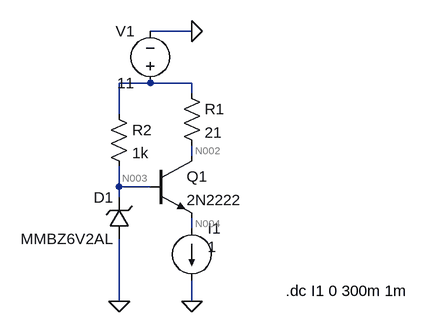
[diagram p0: schematic zener_with_current_limit.asc]
zener_with_current_limit.asc, the LTspice schematic file:
Version 4
SHEET 1 880 680
WIRE 224 -64 160 -64
WIRE 160 16 112 16
WIRE 224 16 160 16
WIRE 224 32 224 16
WIRE 112 64 112 16
WIRE 224 128 224 112
WIRE 112 176 112 144
WIRE 160 176 112 176
WIRE 112 192 112 176
WIRE 224 240 224 224
WIRE 112 352 112 256
WIRE 224 352 224 320
FLAG 112 352 0
FLAG 224 -64 0
FLAG 224 352 0
SYMBOL npn 160 128 R0
SYMATTR InstName Q1
SYMATTR Value 2N2222
SYMBOL res 208 16 R0
SYMATTR InstName R1
SYMATTR Value 21
SYMBOL res 96 48 R0
SYMATTR InstName R2
SYMATTR Value 1k
SYMBOL zener 128 256 R180
WINDOW 0 24 64 Left 2
WINDOW 3 24 0 Left 2
SYMATTR InstName D1
SYMATTR Value MMBZ6V2AL
SYMBOL voltage 160 32 R180
WINDOW 0 24 96 Left 2
WINDOW 3 24 16 Left 2
WINDOW 123 0 0 Left 2
WINDOW 39 0 0 Left 2
SYMATTR InstName V1
SYMATTR Value 11
SYMBOL current 224 240 R0
WINDOW 3 24 28 Left 2
WINDOW 123 0 0 Left 2
WINDOW 39 0 0 Left 2
SYMATTR InstName I1
SYMATTR Value 1
TEXT 368 336 Left 2 !.dc I1 0 300m 1m

The netlist it stands for:
* zener_with_current_limit.asc
Q1 N002 N003 N004 0 2N2222
R1 N001 N002 21
R2 N001 N003 1k
D1 0 N003 MMBZ6V2AL
V1 N001 0 11
I1 N004 0 1
.model D D
.lib standard.dio
.model NPN NPN
.model PNP PNP
.lib standard.bjt
.dc I1 0 300m 1m
.backanno
.end

* Results of the author's LTspice run, read from the files saved beside the schematic
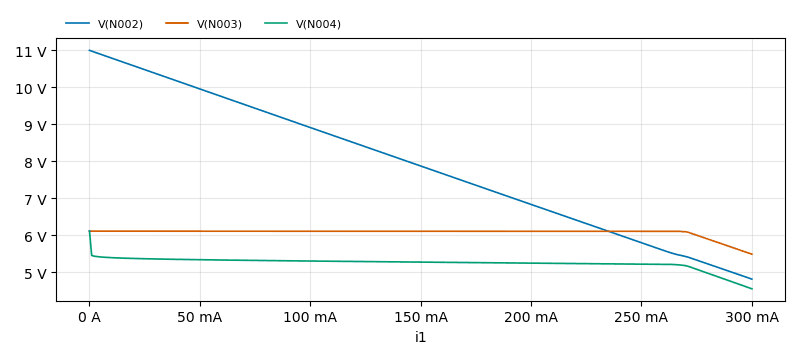
[diagram p1: DC transfer characteristic of zener_with_current_limit.asc, plotted from the saved traces]
* DC transfer characteristic, 1 run:
*   V(N002): 11 V at i1=0 A, 4.816 V at i1=300 mA, min 4.816 V, max 11 V
*   V(N003): 6.112 V at i1=0 A, 5.489 V at i1=300 mA, min 5.489 V, max 6.112 V
*   V(N004): 6.118 V at i1=0 A, 4.553 V at i1=300 mA, min 4.553 V, max 6.118 V